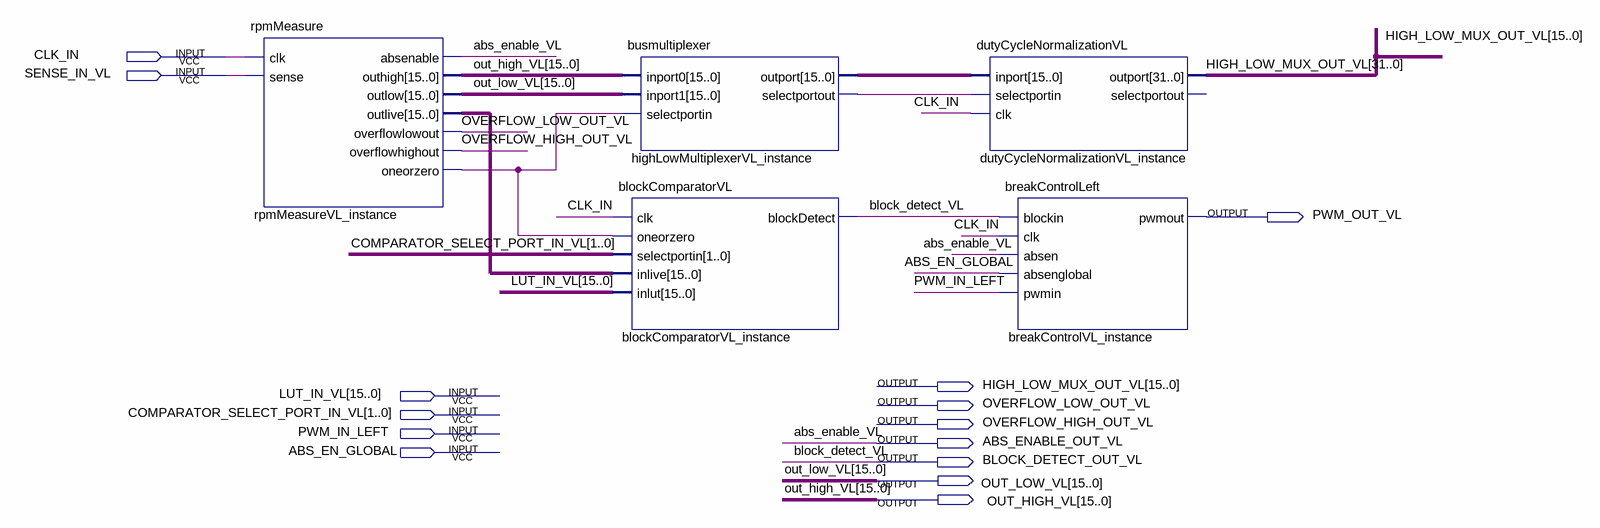
[diagram p0: schematic sheet]
// Quartus schematic absControlVL.bdf as structural Verilog: 5 symbols, 14 pins
module absControlVL (
  input  CLK_IN,
  input  SENSE_IN_VL,
  input  [15:0] LUT_IN_VL,
  input  [1:0] COMPARATOR_SELECT_PORT_IN_VL,
  input  PWM_IN_LEFT,
  input  ABS_EN_GLOBAL,
  output PWM_OUT_VL,
  output [31:0] HIGH_LOW_MUX_OUT_VL,
  output OVERFLOW_LOW_OUT_VL,
  output OVERFLOW_HIGH_OUT_VL,
  output ABS_ENABLE_OUT_VL,
  output BLOCK_DETECT_OUT_VL,
  output [15:0] OUT_LOW_VL,
  output [15:0] OUT_HIGH_VL
);

  wire highLowMultiplexerVL_instance_selectportout, rpmMeasureVL_instance_oneorzero;
  wire [15:0] highLowMultiplexerVL_instance_outport, rpmMeasureVL_instance_outlive;

  rpmMeasure rpmMeasureVL_instance (
    .clk(CLK_IN), .sense(SENSE_IN_VL), .absenable(ABS_ENABLE_OUT_VL), .outhigh(OUT_HIGH_VL),
    .outlow(OUT_LOW_VL), .outlive(rpmMeasureVL_instance_outlive), .overflowlowout(OVERFLOW_LOW_OUT_VL),
    .overflowhighout(OVERFLOW_HIGH_OUT_VL), .oneorzero(rpmMeasureVL_instance_oneorzero));
  busmultiplexer highLowMultiplexerVL_instance (
    .inport0(OUT_HIGH_VL), .inport1(OUT_LOW_VL), .selectportin(rpmMeasureVL_instance_oneorzero),
    .outport(highLowMultiplexerVL_instance_outport),
    .selectportout(highLowMultiplexerVL_instance_selectportout));
  blockComparatorVL blockComparatorVL_instance (
    .clk(CLK_IN), .oneorzero(rpmMeasureVL_instance_oneorzero), .selectportin(COMPARATOR_SELECT_PORT_IN_VL),
    .inlive(rpmMeasureVL_instance_outlive), .inlut(LUT_IN_VL), .blockDetect(BLOCK_DETECT_OUT_VL));
  dutyCycleNormalizationVL dutyCycleNormalizationVL_instance (
    .inport(highLowMultiplexerVL_instance_outport),
    .selectportin(highLowMultiplexerVL_instance_selectportout), .clk(CLK_IN), .outport(HIGH_LOW_MUX_OUT_VL));  // open: selectportout
  breakControlLeft breakControlVL_instance (
    .blockin(BLOCK_DETECT_OUT_VL), .clk(CLK_IN), .absen(ABS_ENABLE_OUT_VL), .absenglobal(ABS_EN_GLOBAL),
    .pwmin(PWM_IN_LEFT), .pwmout(PWM_OUT_VL));

  // Other names for the same wires on the sheet: abs_enable_VL = ABS_ENABLE_OUT_VL;
  //   block_detect_VL = BLOCK_DETECT_OUT_VL
endmodule
